# EAGLE design CC3000_WiFi_Breakout (EAGLE 6.5.0)
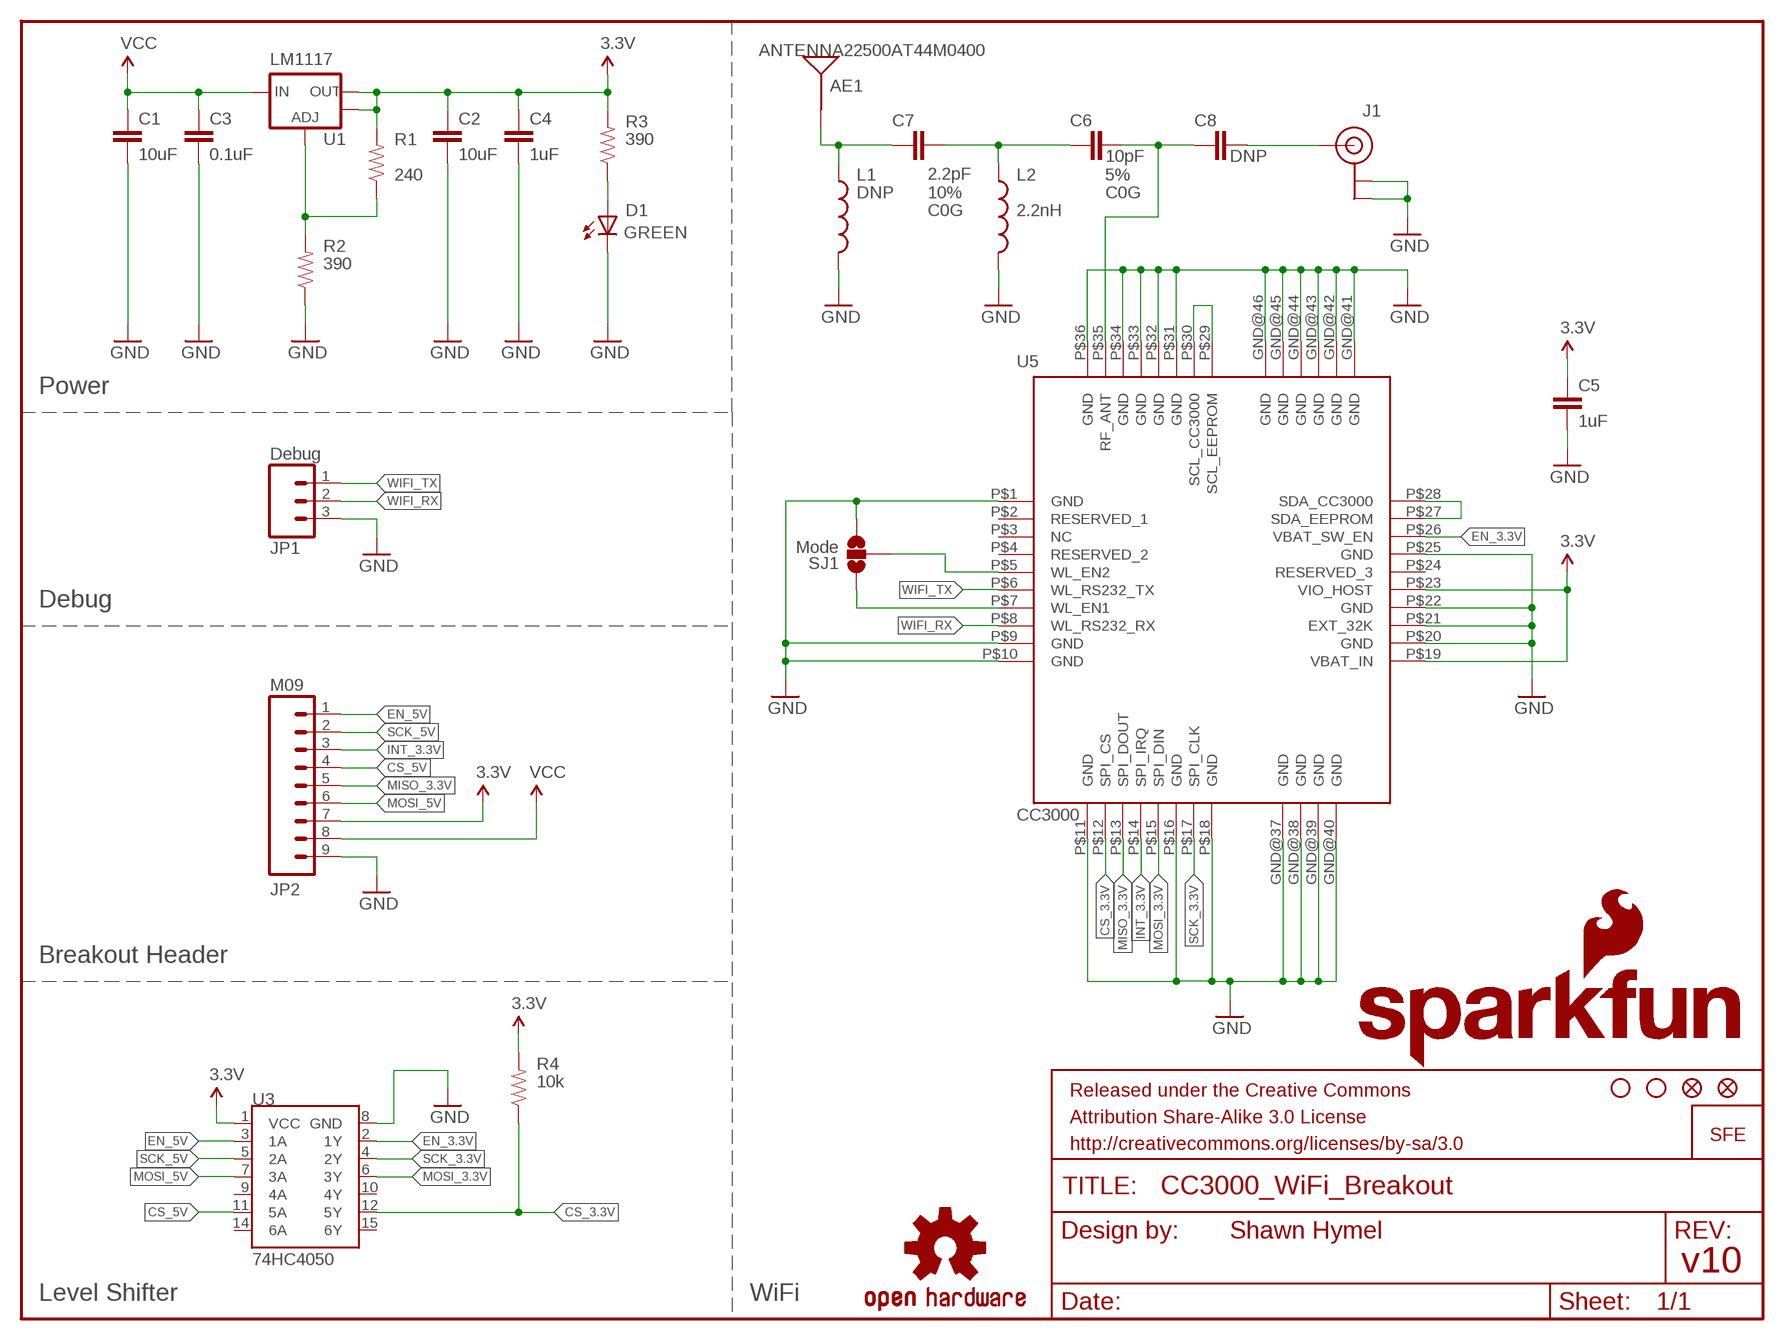
[diagram p0: schematic, sheet 1]

## Parts
AE1  ANTENNA22500AT44M0400  [ANTENNA-CHIP_2500AT44M0400]
C1  10uF  CAP0805  [0805]
C2  10uF  CAP0805  [0805]
C3  0.1uF  CAP0603-CAP  [0603-CAP]
C4  1uF  CAP0805  [0805]
C5  1uF  CAP0805  [0805]
C6  10pF  CAP0603-CAP  [0603-CAP]
C7  2.2pF  CAP0603-CAP  [0603-CAP]
C8  DNP  CAP0603-CAP  [0603-CAP]
D1  GREEN  LED-GREEN0603  [LED-0603]
FID1  FIDUCIAL1X2  [FIDUCIAL-1X2]
FID2  FIDUCIAL1X2  [FIDUCIAL-1X2]
FRAME1  FRAME-LETTER  [CREATIVE_COMMONS]
J1  U.FL  [U.FL]
JP1  Debug  M03PTH  [1X03]
JP2  M09  [1X09]
L1  DNP  INDUCTOR0603  [0603]
L2  2.2nH  INDUCTOR0603  [0603]
LOGO1  OSHW-LOGOS  [OSHW-LOGO-S]
LOGO3  LOGO-SFESK  [SFE-LOGO-FLAME]
LOGO4  SFE_LOGO_NAME_FLAME.1_INCH  [SFE_LOGO_NAME_FLAME_.1]
R1  240  RESISTOR0603  [0603-RES]
R2  390  RESISTOR0603  [0603-RES]
R3  390  RESISTOR0603-RES  [0603-RES]
R4  10k  RESISTOR0603-RES  [0603-RES]
SJ1  Mode  SOLDERJUMPER_2WAYPASTE1&2  [SJ_3_PASTE1&2]
STANDOFF1  STAND-OFF  [STAND-OFF]
STANDOFF2  STAND-OFF  [STAND-OFF]
U1  LM1117  V_REG_LM1117SOT223  [SOT223]
U3  74HC4050  HEX_CONVERTER  [SO016]
U5  CC3000  [QFN-46_CC3000]

## Nets
3.3V: C2.1 C4.1 C5.1 JP2.7 R1.2 R3.2 R4.2 U1.2(OUT) U1.4(OUT) U3.1(VCC) U5.P$19(VBAT_IN) U5.P$23(VIO_HOST)
CS_3.3V: R4.1 U3.12(5Y) U5.P$12(SPI_CS)
CS_5V: JP2.4 U3.11(5A)
EN_3.3V: U3.2(1Y) U5.P$26(VBAT_SW_EN)
EN_5V: JP2.1 U3.3(1A)
GND: C1.2 C2.2 C3.2 C4.2 C5.2 D1.C J1.P$1(GND) J1.P$2(GND) JP1.3 JP2.9 L1.2 L2.2 R2.1 SJ1.3 U3.8(GND) U5.GND@37(GND) U5.GND@38(GND) U5.GND@39(GND) U5.GND@40(GND) U5.GND@41(GND) U5.GND@42(GND) U5.GND@43(GND) U5.GND@44(GND) U5.GND@45(GND) U5.GND@46(GND) U5.P$1(GND) U5.P$9(GND) U5.P$10(GND) U5.P$11(GND) U5.P$16(GND) U5.P$18(GND) U5.P$20(GND) U5.P$21(EXT_32K) U5.P$22(GND) U5.P$25(GND) U5.P$31(GND) U5.P$32(GND) U5.P$33(GND) U5.P$34(GND) U5.P$36(GND)
INT_3.3V: JP2.3 U5.P$14(SPI_IRQ)
MISO_3.3V: JP2.5 U5.P$13(SPI_DOUT)
MOSI_3.3V: U3.6(3Y) U5.P$15(SPI_DIN)
MOSI_5V: JP2.6 U3.7(3A)
N$2: R1.1 R2.2 U1.1(ADJ)
N$3: SJ1.2 U5.P$5(WL_EN2)
N$4: SJ1.1 U5.P$7(WL_EN1)
N$5: C6.1 C7.2 L2.1
N$6: U5.P$27(SDA_EEPROM) U5.P$28(SDA_CC3000)
N$7: U5.P$29(SCL_EEPROM) U5.P$30(SCL_CC3000)
N$8: C6.2 C8.1 U5.P$35(RF_ANT)
N$9: C8.2 J1.P$3(SIGNAL)
N$10: AE1.FEED(SIGNAL) C7.1 L1.1
N$11: D1.A R3.1
SCK_3.3V: U3.4(2Y) U5.P$17(SPI_CLK)
SCK_5V: JP2.2 U3.5(2A)
VCC: C1.1 C3.1 JP2.8 U1.3(IN)
WIFI_RX: JP1.2 U5.P$8(WL_RS232_RX)
WIFI_TX: JP1.1 U5.P$6(WL_RS232_TX)
Unconnected: U3.9(4A) U3.10(4Y) U3.14(6A) U3.15(6Y) U5.P$2(RESERVED_1) U5.P$3(NC) U5.P$4(RESERVED_2) U5.P$24(RESERVED_3)

## Notes on the sheet
- Power
- Debug
- Breakout Header
- Shawn Hymel
- v10
- Level Shifter | WiFi

## Library data of the parts
AE1 = SparkFun-RF:ANTENNA2: Chip antenna Single endded antenna. Common with smaller chip antennas. CHIP4 package is the GPS Chip Antenna SKU: GPS-08418. CHIP5 package is 2.4GHz chip antenna SKU: WRL-00144.
C1-C5 C8 = SparkFun-Capacitors:CAP: Capacitor Standard 0603 ceramic capacitor, and 0.1" leaded capacitor.
C6 = SparkFun-Capacitors:CAP: Capacitor Standard 0603 ceramic capacitor, and 0.1" leaded capacitor.; COEFF: C0G; TOL: 5%
C7 = SparkFun-Capacitors:CAP: Capacitor Standard 0603 ceramic capacitor, and 0.1" leaded capacitor.; COEFF: C0G; TOL: 10%
D1 = SparkFun-LED:LED-GREEN: Various green LEDs 0603- DIO-00821 LARGE- DIO-00862 LILYPAD- DIO-09910; PROD_ID: DIO-00821
FID1 FID2 = SparkFun-Aesthetics:FIDUCIAL: Fiducial Alignment Points Various fiducial points for machine vision alignment.
FRAME1 = SparkFun-Aesthetics:FRAME-LETTER: Schematic Frame Standard 8.5x11 US Letter frame
J1 = SparkFun-Connectors:U.FL: SMD antenna connector- WRL-09144
JP1 = SparkFun-Connectors:M03: Header 3 Standard 3-pin 0.1" header. Use with straight break away headers (SKU : PRT-00116), right angle break away headers (PRT-00553), swiss pins (PRT-00743), machine pins (PRT-00117), and female headers (PRT-00115). Molex polarized connector foot print use with SKU : PRT-08232 with associated crimp pins and housings.
JP2 = SparkFun-Connectors:M09: Header 9 Standard 9-pin 0.1" header. Use with straight break away headers (SKU : PRT-00116), right angle break away headers (PRT-00553), swiss pins (PRT-00743), machine pins (PRT-00117), and female headers (PRT-00115).
L1 L2 = SparkFun-Passives:INDUCTOR: Inductors Basic Inductor/Choke - 0603 and 1206. Footprints are not proven and vary greatly between part numbers. SRN6045- 33uH, 20% 1.4A
LOGO1 = SparkFun-Aesthetics:OSHW-LOGO: Open Source Hardware Logo This logo indicates the piece of hardware it is found on incorporates a OSHW license and/or adheres to the definition of open source hardware found here: http://freedomdefined.org/OSHW
LOGO3 = SparkFun-Aesthetics:LOGO-SFE: Spark Fun Electronics PCB Logo This is the standard Spark Fun Electronics PCB logo.
LOGO4 = SparkFun-Aesthetics:SFE_LOGO_NAME_FLAME: SFE Logo, name and flame This is the SparkFun full logo. The logo on the schematic will always be the same size; the package variant is the height of the flame part of the logo. Default layer for the logo on the board is tSilk.
R1-R4 = SparkFun-Resistors:RESISTOR: Resistor Basic schematic elements and footprints for 0603, 1206, and PTH resistors.
SJ1 = SparkFun-Passives:SOLDERJUMPER_2WAY: Solder Jumper 2 way solder jumper
STANDOFF1 STANDOFF2 = SparkFun-Electromechanical:STAND-OFF: #4 Stand Off This is the mechanical footprint for a #4 phillips button head screw. Use the keepout ring to avoid running the screw head into surrounding components. SKU : PRT-00447
U1 = SparkFun-PowerIC:V_REG_LM1117: Voltage Regulator LM1117 Standard adjustable voltage regulator but in SMD form. Spark Fun Electronics SKU : COM-00595
U3 = SparkFun-DigitalIC:HEX_CONVERTER: Just what it says.
U5 = SparkFun-RF:CC3000: TI CC3000 WiFi Module

## Board
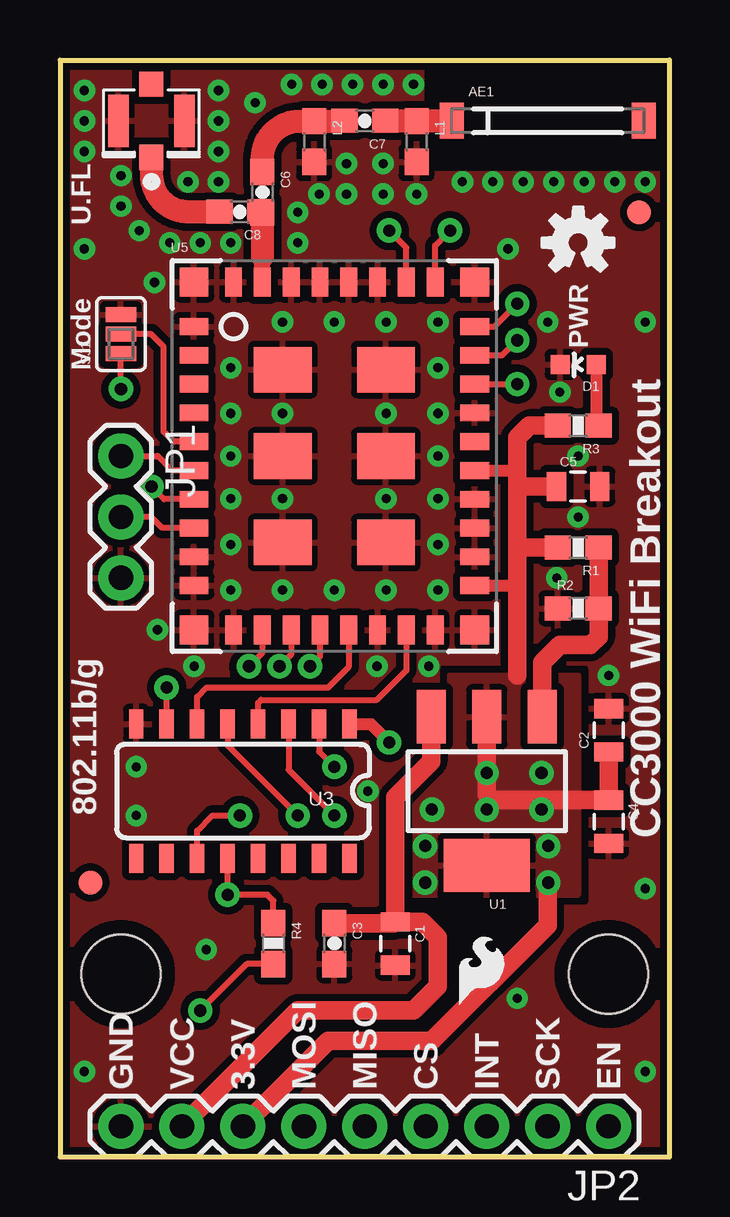
[diagram p1: board, top side]
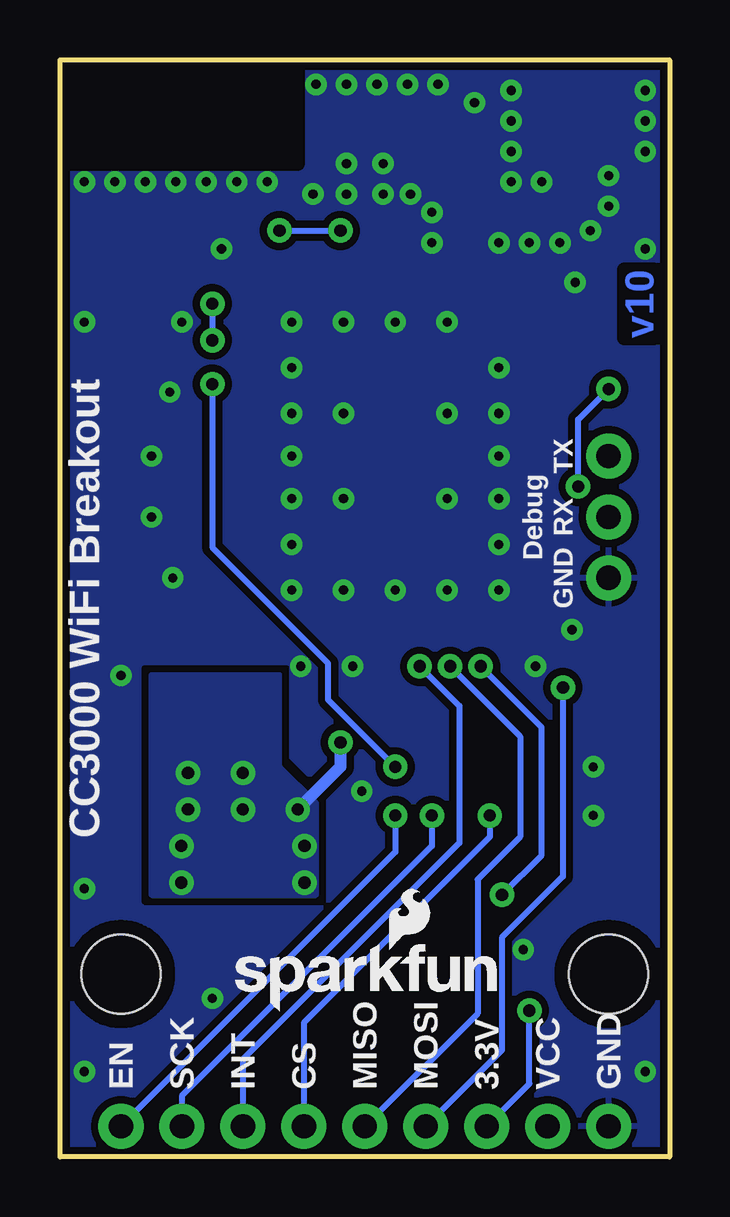
[diagram p2: board, bottom side, seen from below]

Size 25.4 x 45.72 mm. Coordinates in mm from the lower left corner, seen from the top.
Outline: 0,45.72 0,0 25.4,0 25.4,45.72 0,45.72
Copper layers (1*16): Top 0.035mm / dielectric 1.5mm / Bottom 0.035mm
Design rules "SparkFun-2-layer": minimum track width 7mil, minimum drill 15mil, track to track 8mil, track to pad 8mil, pad to pad 8mil, via to via 8mil, smd to smd 8mil, copper to edge 8mil, drill to drill 8mil, minimum pad ring 12mil, minimum via ring 10mil, stop-mask expansion 4mil, vias tented up to drill 20mil, thermal gap 10mil
tRestrict: area 15.5,41.4 to 25.1,45.7
bRestrict: area 15.5,41.4 to 25.1,45.7

### Footprints (pad centres in the part's own frame; a part is rotated, then mirrored left to right if it is on the bottom)
ANTENNA-CHIP_2500AT44M0400 = smd 1 x 1.5: FEED -4,0; NC 4,0
0805 = smd 0.8 x 1.2: 1 -0.9,0; 2 0.9,0
0603-CAP = smd 1.1 x 1: 1 -0.85,0; 2 0.85,0
LED-0603 = smd 0.8 x 0.8: A 0,-0.75; C 0,0.75
FIDUCIAL-1X2 = smd 1 x 1: 1 0,0
U.FL = smd 2.2 x 0.85: P$1 0,1.375; P$2 0,-1.375 | smd 1.05 x 1: P$3 1.525,0; P$4 -1.525,0
1X03 = drill 1.016 pad 1.88: 1 0,0; 2 2.54,0; 3 5.08,0
1X09 = drill 1.016 pad 1.88: 1 0,0; 2 2.54,0; 3 5.08,0; 4 7.62,0; 5 10.16,0; 6 12.7,0; 7 15.24,0; 8 17.78,0; 9 20.32,0
0603 = smd 1.1 x 1: 1 -0.85,0; 2 0.85,0
0603-RES = smd 1.1 x 1: 1 -0.85,0; 2 0.85,0
SJ_3_PASTE1&2 = smd 0.635 x 1.27: 1 -0.813,0; 2 0,0; 3 0.813,0
STAND-OFF = hole 3.302: 0,0
SOT223 = smd 1.219 x 2.235: 1 -2.311,-3.099; 2 0,-3.099; 3 2.311,-3.099 | smd 3.6 x 2.2: 4 0,3.099
SO016 = smd 0.6 x 1.2: 1 -4.445,-2.8; 2 -3.175,-2.8; 3 -1.905,-2.8; 4 -0.635,-2.8; 5 0.635,-2.8; 6 1.905,-2.8; 7 3.175,-2.8; 8 4.445,-2.8; 9 4.445,2.8; 10 3.175,2.8; 11 1.905,2.8; 12 0.635,2.8; 13 -0.635,2.8; 14 -1.905,2.8; 15 -3.175,2.8; 16 -4.445,2.8
QFN-46_CC3000 = smd 2.4 x 1.9: GND@37 -2.15,3.6; GND@38 -2.15,0; GND@39 -2.15,-3.6; GND@40 2.15,3.6; GND@41 2.15,0; GND@42 2.15,-3.6 | smd 1.2 x 1.2: GND@43 -5.85,7.25; GND@44 -5.85,-7.25; GND@45 5.85,-7.25; GND@46 5.85,7.25 | smd 1.2 x 0.7: P$1 -5.85,5.4; P$2 -5.85,4.2; P$3 -5.85,3; P$4 -5.85,1.8; P$5 -5.85,0.6; P$6 -5.85,-0.6; P$7 -5.85,-1.8; P$8 -5.85,-3; P$9 -5.85,-4.2; P$10 -5.85,-5.4; P$19 5.85,-5.4; P$20 5.85,-4.2; P$21 5.85,-3; P$22 5.85,-1.8; P$23 5.85,-0.6; P$24 5.85,0.6; P$25 5.85,1.8; P$26 5.85,3; P$27 5.85,4.2; P$28 5.85,5.4 | smd 0.7 x 1.2: P$11 -4.2,-7.25; P$12 -3,-7.25; P$13 -1.8,-7.25; P$14 -0.6,-7.25; P$15 0.6,-7.25; P$16 1.8,-7.25; P$17 3,-7.25; P$18 4.2,-7.25; P$29 4.2,7.25; P$30 3,7.25; P$31 1.8,7.25; P$32 0.6,7.25; P$33 -0.6,7.25; P$34 -1.8,7.25; P$35 -3,7.25; P$36 -4.2,7.25

### Placement (x,y rotation side)
AE1  20.32,43.18 0 top
C1  13.97,8.89 270 top
C2  22.86,17.78 90 top
C3  11.43,8.89 270 top
C4  22.86,13.97 270 top
C5  21.59,27.94 0 top
C6  8.43,40.21 270 top
C7  12.7,43.18 180 top
C8  7.49,39.4 180 top
D1  21.59,33.02 90 top
FID1  24.13,39.37 0 top
FID2  1.27,11.43 0 top
FRAME1  -17.78,-10.16 0 top  (outside the outline)
J1  3.81,43.18 270 top
JP1  2.54,29.21 270 top
JP2  22.86,1.27 180 top
L1  14.86,42.32 270 top
L2  10.59,42.32 270 top
LOGO1  21.59,38.1 0 top
LOGO3  16.64,6.35 0 top
LOGO4  18.54,5.97 0 bottom
R1  21.59,25.4 180 top
R2  21.59,22.86 0 top
R3  21.59,30.48 180 top
R4  8.89,8.89 270 top
SJ1  2.54,34.29 90 top
STANDOFF1  22.86,7.62 90 top
STANDOFF2  2.54,7.62 90 top
U1  17.78,15.24 180 top
U3  7.62,15.24 180 top
U5  11.43,29.21 0 top

### Tracks (layer width: path | path; a pad name or v marks a point on that pad's centre or on a via)
3.3V  (via drill 0.51)
  Top 0.254: R4.2 7.79,8.04 v5.84,6.1
  Top 0.508: U5.P$23 18.96,28.61 19.05,28.7 | U5.P$19 18.98,23.81 19.05,23.88 | 19.3,25.4 19.05,25.65 | U3.1 12.95,18.04 v13.72,17.27
  Top 0.762: 19.05,20.07 19.05,23.88 19.05,25.65 19.05,27.94 | 19.05,27.94 19.05,28.7 19.05,29.97 19.56,30.48 R3.2 | C5.1 19.05,27.94 | R1.2 19.3,25.4 | C2.1 C4.1 18.02,14.87 17.78,15.11 U1.2 | v20.34,11.43 20.32,11.4 20.32,9.65 15.49,4.83 11.18,4.83 JP2.7
  Bottom 0.254: JP2.7 5.84,3.05 v5.84,6.1
  Bottom 0.508: v13.72,17.27 13.72,16.26 v15.49,14.48
  other vias: 20.07,16 20.07,14.48 17.78,16 17.78,14.48 20.35,12.95 15.21,11.43 15.21,12.95
  pour Top (isolate 0.305): 16.26,20.07 21.59,20.07 21.59,10.92 14.73,10.92 14.73,14.73 16.26,16.26
  pour Bottom (isolate 0.305): 16.26,20.07 21.59,20.07 21.59,10.92 14.73,10.92 14.73,14.73 16.26,16.26
CS_3.3V  (via drill 0.51)
  Top 0.254: U5.P$12 8.43,21 v7.87,20.45 | U3.12 v6.99,10.92 8.64,10.92 8.89,10.67 R4.1
  Bottom 0.254: v6.99,10.92 5.33,12.57 5.33,17.91 v7.87,20.45
CS_5V  (via drill 0.51)
  Top 0.254: U3.11 5.71,13.59 6.35,14.22 v7.49,14.22
  Bottom 0.254: v7.49,14.22 7.49,13.34 15.24,5.59 JP2.4
EN_3.3V  (via drill 0.51)
  Top 0.254: U5.P$26 v19.05,32.21 | U3.2 10.79,16.89 v11.43,16.26
  Bottom 0.254: v11.43,16.26 14.22,19.05 14.22,20.57 19.05,25.4 v19.05,32.21
EN_5V  (via drill 0.51)
  Top 0.254: U3.3 9.53,16.13 v11.43,14.22
  Bottom 0.254: v11.43,14.22 11.43,12.7 JP2.1
GND  (via drill 0.38)
  other vias: 24.38,40.64 23.11,40.64 21.84,40.64 20.57,40.64 19.3,40.64 18.03,40.64 13.46,40.13 9.91,38.1 7.11,38.1 5.84,38.1 4.57,38.1 3.3,38.61 2.54,39.62 2.54,40.89 1.02,43.18 1.02,41.91 1.02,44.45 6.6,43.18 6.6,44.45 6.6,41.91 5.33,40.64 13.59,34.8 9.27,34.8 11.43,34.8 15.75,34.8 15.75,30.99 15.75,27.43 15.75,23.62 11.43,23.62 7.11,23.62 7.11,27.43 7.11,30.99 7.11,32.89 7.11,25.53 15.75,32.89 15.75,25.53 15.75,29.21 7.11,29.21 9.27,23.62 13.59,23.62 9.27,30.99 13.59,30.99 9.27,27.43 13.59,27.43 1.02,37.85 3.94,36.45 6.6,40.64 18.67,37.85 24.38,34.8 20.83,31.88 20.32,34.8 21.59,29.21 21.59,26.67 20.7,24.13 24.38,11.18 24.38,3.56 6.1,8.64 19.05,6.6 3.17,16.26 3.17,14.22 4.06,21.97 5.59,20.45 13.21,20.45 15.37,20.45 22.86,20.07 16.76,40.64 14.86,40.13 13.46,41.4 11.94,41.4 11.94,40.13 9.91,39.37 10.79,40.13 13.46,44.7 14.73,44.7 12.19,44.7 10.92,44.7 9.65,44.7 8.13,43.94 12.83,15.24 1.02,3.56
  pour Bottom (isolate 0.305, rank 6): 0,0 0,45.72 25.4,45.72 25.4,0
  pour Top (isolate 0.305, rank 6): 0,0 0,45.72 25.4,45.72 25.4,0
INT_3.3V  (via drill 0.51)
  Top 0.254: U5.P$14 10.83,20.86 v10.41,20.45
  Bottom 0.254: v10.41,20.45 8.76,18.8 8.76,13.08 17.78,4.06 JP2.3
MISO_3.3V  (via drill 0.51)
  Top 0.254: U5.P$13 9.63,20.93 v9.14,20.45
  Bottom 0.254: v9.14,20.45 6.22,17.53 6.22,13.34 8,11.56 8,5.97 JP2.5
MOSI_3.3V
  Top 0.254: U5.P$15 12.03,20.41 11.18,19.56 6.1,19.56 5.71,19.18 U3.6
MOSI_5V  (via drill 0.51)
  Top 0.254: U3.7 v4.45,19.56
  Bottom 0.254: v4.45,19.56 4.45,11.68 6.99,9.14 6.99,4.45 JP2.6
N$2
  Top 0.762: R1.1 R2.2 22.44,21.68 22.1,21.34 20.83,21.34 20.09,20.6 U1.1
N$3
  Top 0.254: U5.P$5 4.73,29.81 4.32,30.23 4.32,33.78 3.81,34.29 SJ1.2
N$4  (via drill 0.51)
  Top 0.254: U5.P$7 4.34,27.41 v3.81,27.94 | v2.54,32 SJ1.1
  Bottom 0.254: v3.81,27.94 3.81,30.73 v2.54,32
N$5
  Top 0.965: C6.1 8.43,41.62 arc-90 9.98,43.17 L2.1 arc-90 L2.1 11.84,43.17 arc90 C7.2
N$6  (via drill 0.51)
  Top 0.254: U5.P$27 18.42,33.41 v19.05,34.04 | U5.P$28 18.1,34.61 v19.05,35.56
  Bottom 0.254: v19.05,35.56 v19.05,34.04
N$7  (via drill 0.51)
  Top 0.254: U5.P$30 14.43,37.89 v13.72,38.61 | U5.P$29 15.63,37.98 v16.26,38.61
  Bottom 0.254: v16.26,38.61 v13.72,38.61
N$8
  Top 0.254: C8.1 8.4,39.4 C6.2
  Top 0.66: U5.P$35 8.43,37.54 arc-90 8.43,37.54
  Top 0.965: C6.2 8.43,37.54
N$9
  Top 0.965: J1.P$3 3.81,40.92 arc90 5.33,39.4 C8.2
N$10
  Top 0.965: C7.1 14.85,43.18 | 14.85,43.18 arc-90 L1.1 | 14.85,43.18 AE1.FEED
N$11
  Top 0.508: D1.A 22.34,30.58 R3.1
SCK_3.3V
  Top 0.254: U5.P$17 14.43,20.27 13.21,19.05 8.38,19.05 8.26,18.92 U3.4
SCK_5V  (via drill 0.51)
  Top 0.254: U3.5 6.99,17.14 v9.91,14.22
  Bottom 0.254: v9.91,14.22 9.91,12.95 20.32,2.54 JP2.2
VCC
  Top 0.762: U1.3 15.47,16.48 13.97,14.99 C1.1 | C3.1 13.92,9.74 C1.1 | C1.1 15.1,9.79 15.75,9.14 15.75,7.11 14.73,6.1 9.91,6.1 JP2.8
WIFI_RX
  Top 0.254: U5.P$8 4.27,26.21 3.81,26.67 JP1.2
WIFI_TX
  Top 0.254: JP1.1 4.06,29.21 4.66,28.61 U5.P$6

### Text on the board
Bottom: v10
tPlace: U.FL | PWR | Mode | CC3000 WiFi Breakout | 802.11b/g | GND | VCC | 3.3V | MOSI | MISO | CS | INT | SCK | EN
bPlace: TX | RX | Debug | GND | CC3000 WiFi Breakout | GND | VCC | 3.3V | MOSI | MISO | CS | INT | SCK | EN
tDocu: Shawn Hymel